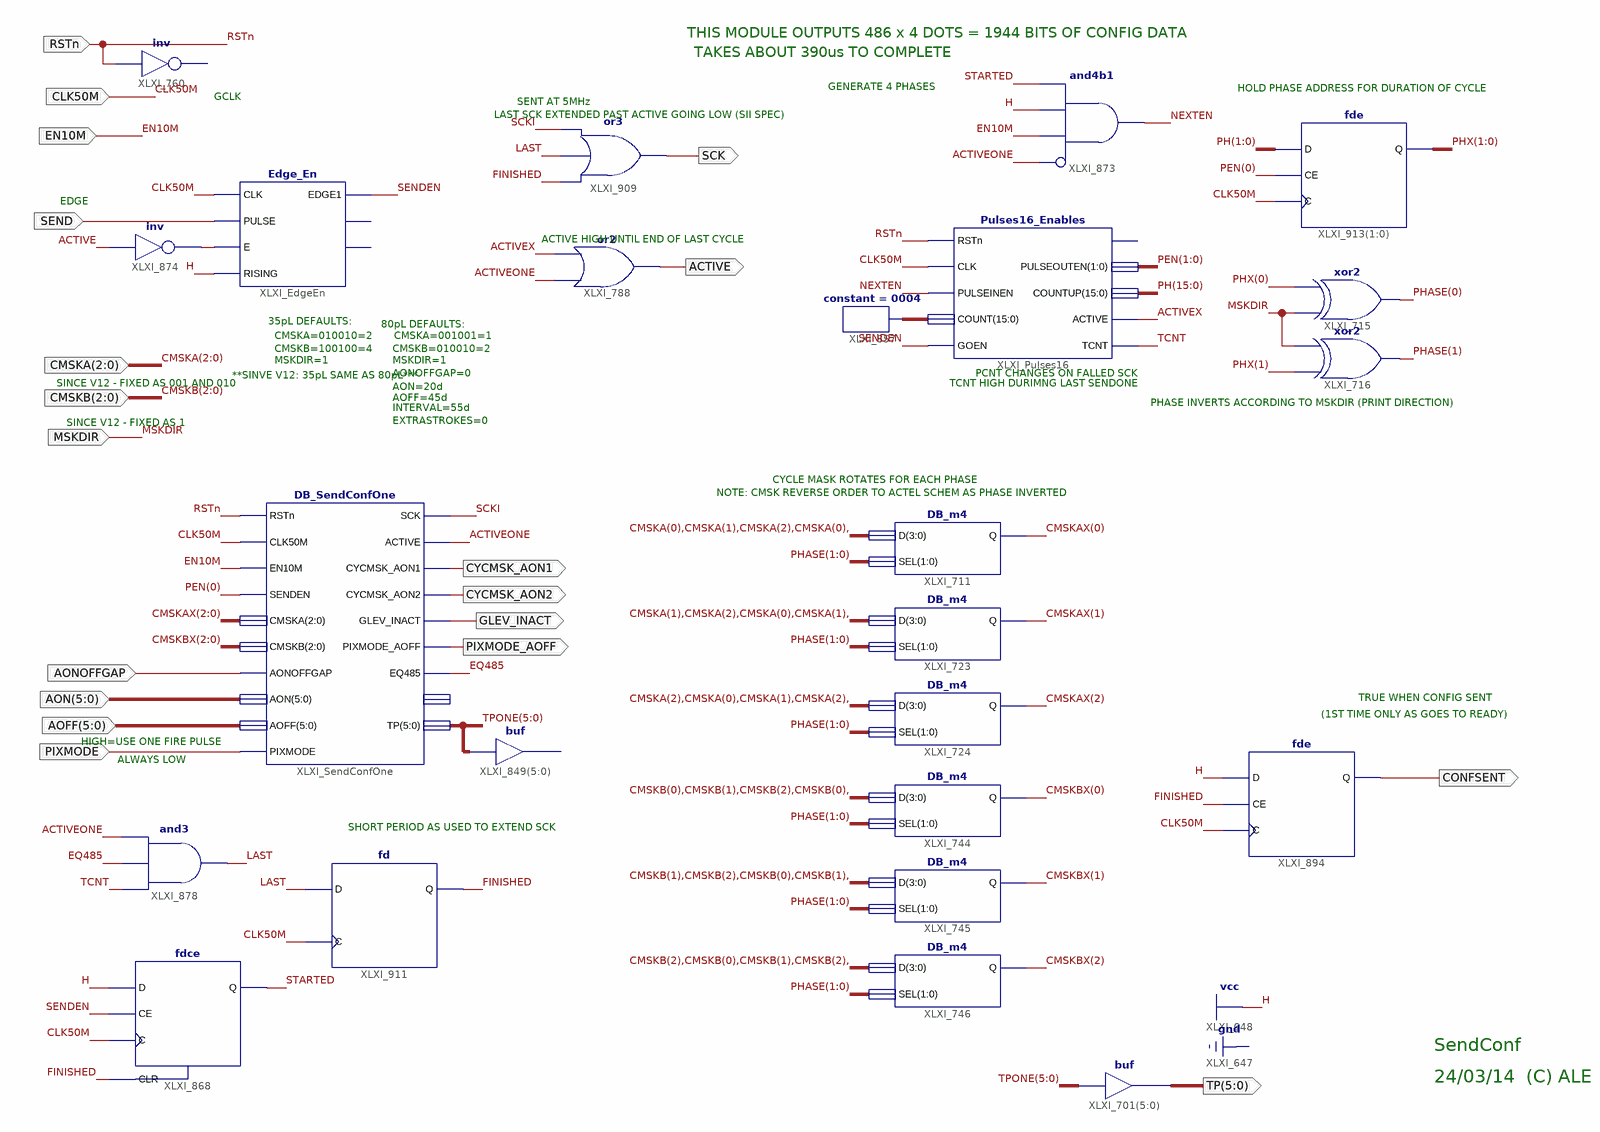
[diagram p0: schematic sheet 1]
// Xilinx ISE schematic DB_SendConf.sch (spartan3e) as structural Verilog: 24 symbols, 19 ports
module DB_SendConf (
  input  RSTn,
  input  MSKDIR,
  input  EN10M,
  input  CLK50M,
  input  [5:0] AON,
  input  [5:0] AOFF,
  input  AONOFFGAP,
  input  PIXMODE,
  input  SEND,
  input  [2:0] CMSKA,
  input  [2:0] CMSKB,
  output [5:0] TP,
  output ACTIVE,
  output CYCMSK_AON1,
  output CYCMSK_AON2,
  output GLEV_INACT,
  output PIXMODE_AOFF,
  output CONFSENT,
  output SCK
);

  wire ACTIVEONE, ACTIVEX, EQ485, FINISHED, LAST, NEXTEN, SCKI, SENDEN, STARTED, TCNT, XLXN_1037;
  wire [1:0] PEN, PHASE, PHX;
  wire [2:0] CMSKAX, CMSKBX;
  wire [5:0] TPONE;
  wire [15:0] PH, XLXN_722;

  assign TP = TPONE;  // buf XLXI_701[5..0], 6 bits wide
  // inv XLXI_760 has open pins: I=RSTn, O=open
  DB_SendConfOne XLXI_SendConfOne (
    .ACTIVE(ACTIVEONE), .AOFF(AOFF), .AON(AON), .AONOFFGAP(AONOFFGAP), .CLK50M(CLK50M), .CMSKA(CMSKAX),
    .CMSKB(CMSKBX), .CYCMSK_AON1(CYCMSK_AON1), .CYCMSK_AON2(CYCMSK_AON2), .EN10M(EN10M), .EQ485(EQ485),
    .GLEV_INACT(GLEV_INACT), .PIXMODE(PIXMODE), .PIXMODE_AOFF(PIXMODE_AOFF), .RSTn(RSTn), .SCK(SCKI),
    .SENDEN(PEN[0]), .TP(TPONE));  // open: CNT
  // buf XLXI_849[5..0] has open pins: I=TPONE, O=open
  and XLXI_878 (LAST, TCNT, EQ485, ACTIVEONE);
  xor XLXI_715 (PHASE[0], MSKDIR, PHX[0]);
  xor XLXI_716 (PHASE[1], PHX[1], MSKDIR);
  constant #(.CValue("0004")) XLXI_857 (.O(XLXN_722));
  Pulses16_Enables XLXI_Pulses16 (
    .ACTIVE(ACTIVEX), .CLK(CLK50M), .COUNT(XLXN_722), .COUNTUP(PH), .GOEN(SENDEN), .PULSEINEN(NEXTEN),
    .PULSEOUTEN(PEN), .RSTn(RSTn), .TCNT(TCNT));  // open: PULSEOUT
  fdce XLXI_868 (.C(CLK50M), .CE(SENDEN), .CLR(FINISHED), .D(1'b1), .Q(STARTED));
  fd XLXI_911 (.C(CLK50M), .D(LAST), .Q(FINISHED));
  not XLXI_874 (XLXN_1037, ACTIVE);
  Edge_En XLXI_EdgeEn (
    .CLK(CLK50M), .E(XLXN_1037), .EDGE1(SENDEN), .PULSE(SEND), .RISING(1'b1));  // open: EDGE0, EDGEQUICK
  fde XLXI_894 (.C(CLK50M), .CE(FINISHED), .D(1'b1), .Q(CONFSENT));
  DB_m4 XLXI_711 (.D({CMSKA[0], CMSKA[1], CMSKA[2], CMSKA[0]}), .Q(CMSKAX[0]), .SEL(PHASE));
  DB_m4 XLXI_723 (.D({CMSKA[1], CMSKA[2], CMSKA[0], CMSKA[1]}), .Q(CMSKAX[1]), .SEL(PHASE));
  DB_m4 XLXI_724 (.D({CMSKA[2], CMSKA[0], CMSKA[1], CMSKA[2]}), .Q(CMSKAX[2]), .SEL(PHASE));
  DB_m4 XLXI_744 (.D({CMSKB[0], CMSKB[1], CMSKB[2], CMSKB[0]}), .Q(CMSKBX[0]), .SEL(PHASE));
  DB_m4 XLXI_745 (.D({CMSKB[1], CMSKB[2], CMSKB[0], CMSKB[1]}), .Q(CMSKBX[1]), .SEL(PHASE));
  DB_m4 XLXI_746 (.D({CMSKB[2], CMSKB[0], CMSKB[1], CMSKB[2]}), .Q(CMSKBX[2]), .SEL(PHASE));
  or XLXI_788 (ACTIVE, ACTIVEONE, ACTIVEX);
  or XLXI_909 (SCK, FINISHED, LAST, SCKI);
  and XLXI_873 (NEXTEN, ~ACTIVEONE, EN10M, 1'b1, STARTED);  // and4b1
  fde XLXI_913[1:0] (.C(CLK50M), .CE(PEN[0]), .D(PH[1:0]), .Q(PHX));

  // Notes on the sheet:
  //   THIS MODULE OUTPUTS 486 x 4 DOTS = 1944 BITS OF CONFIG DATA
  //   TAKES ABOUT 390us TO COMPLETE
  //   GENERATE 4 PHASES
  //   HOLD PHASE ADDRESS FOR DURATION OF CYCLE
  //   GCLK
  //   SENT AT 5MHz
  //   LAST SCK EXTENDED PAST ACTIVE GOING LOW (SII SPEC)
  //   EDGE
  //   ACTIVE HIGH UNTIL END OF LAST CYCLE
  //   35pL DEFAULTS:
  //   80pL DEFAULTS:
  //   CMSKA=010010=2
  //   CMSKA=001001=1
  //   CMSKB=100100=4
  //   CMSKB=010010=2
  //   MSKDIR=1
  //   MSKDIR=1
  //   AONOFFGAP=0
  //   PCNT CHANGES ON FALLED SCK
  //   **SINVE V12: 35pL SAME AS 80pL***
  //   SINCE V12 - FIXED AS 001 AND 010
  //   TCNT HIGH DURIMNG LAST SENDONE
  //   AON=20d
  //   AOFF=45d
  //   PHASE INVERTS ACCORDING TO MSKDIR (PRINT DIRECTION)
  //   INTERVAL=55d
  //   EXTRASTROKES=0
  //   SINCE V12 - FIXED AS 1
  //   CYCLE MASK ROTATES FOR EACH PHASE
  //   NOTE: CMSK REVERSE ORDER TO ACTEL SCHEM AS PHASE INVERTED
  //   TRUE WHEN CONFIG SENT
  //   (1ST TIME ONLY AS GOES TO READY)
  //   HIGH=USE ONE FIRE PULSE
  //   ALWAYS LOW
  //   SHORT PERIOD AS USED TO EXTEND SCK
  //   SendConf
  //   24/03/14  (C) ALE
endmodule
